# Altium schematic sheet Sensor_Glove_ECG-X01.SchDoc: ECG
size Letter; Organization: GEORGIA TECH; Address1: NORTH AVE NW; Address2: ATLANTA, GA, 30332; DocumentNumber: P001; Revision: X01; SheetNumber: 4; SheetTotal: 4
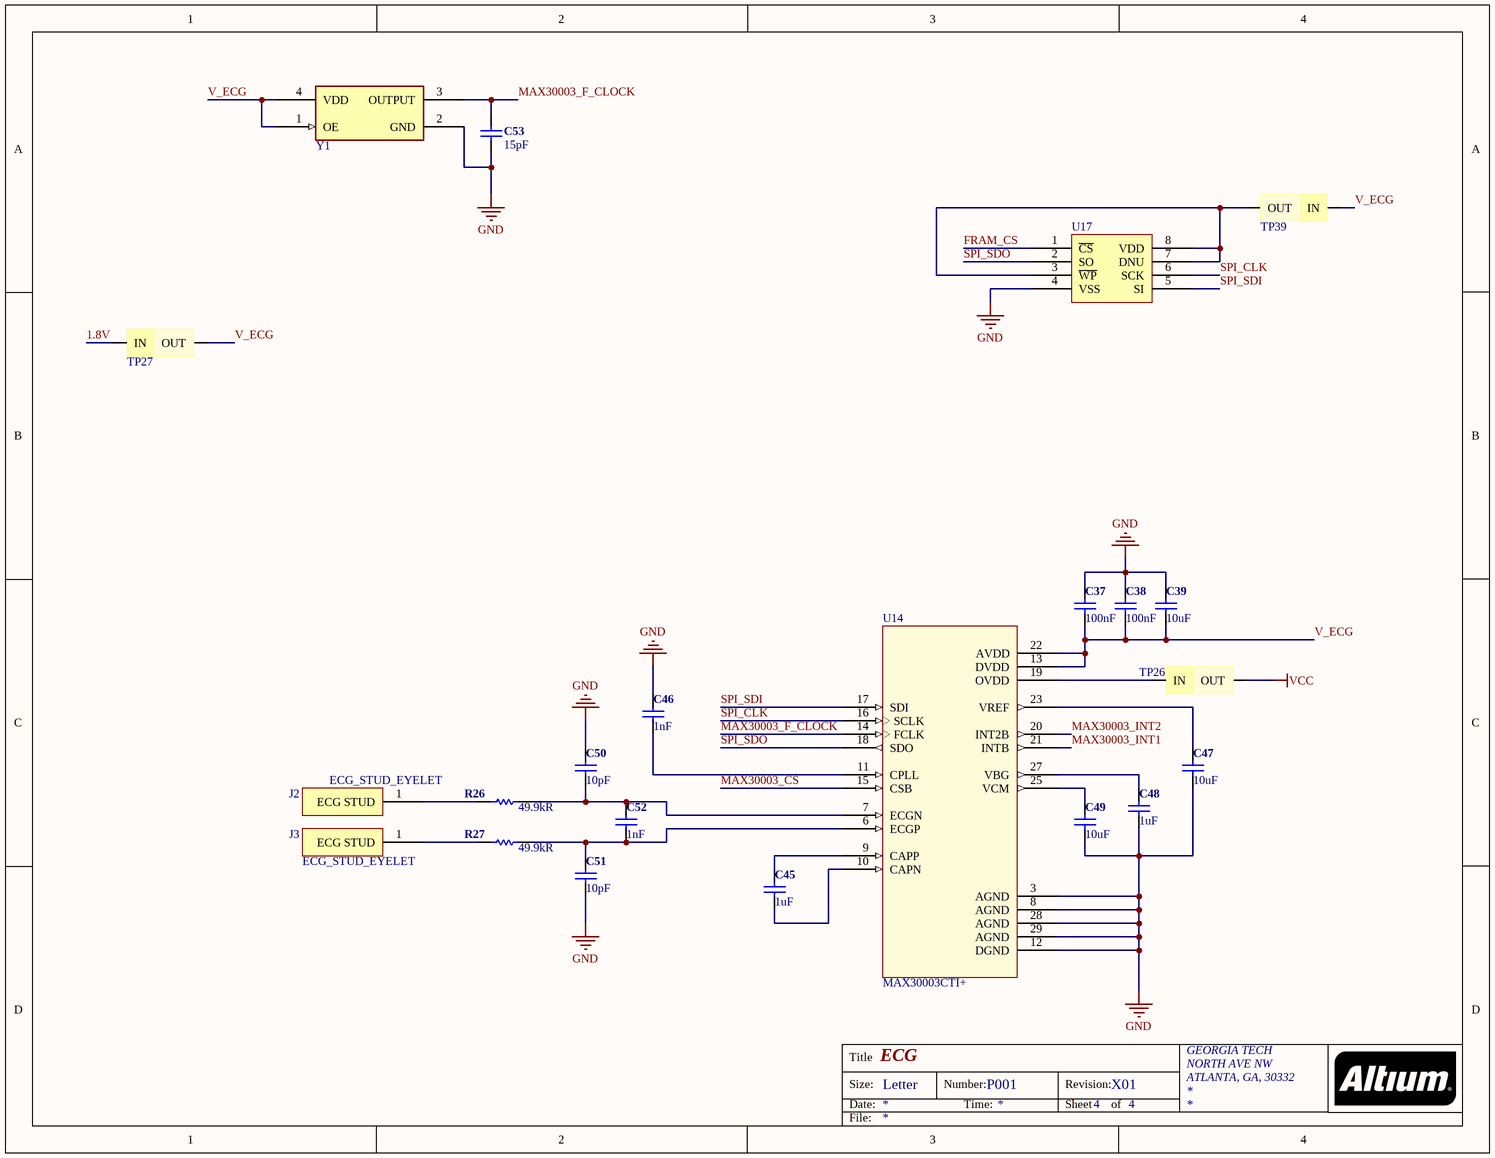
[diagram p0: Sensor_Glove_ECG-X01.SchDoc]

## Parts
C37  100nF  [C0603]
C38  100nF  [C0603]
C39  10uF  [C0603]
C45  1uF  [C0402]
C46  1nF  [C0402]
C47  10uF  [C0603]
C48  1uF  [C0402]
C49  10uF  [C0603]
C50  10pF  [C0402]
C51  10pF  [C0402]
C52  1nF  [C0402]
C53  15pF  [C0402]
J2  ECG_STUD_EYELET  [ECG_STUD]
J3  ECG_STUD_EYELET  [ECG_STUD]
R26  49.9kR  [R0402]
R27  49.9kR  [R0402]
TP26  JUMPER  [JUMPER]  (value not drawn)
TP27  JUMPER  [JUMPER]  (value not drawn)
TP39  JUMPER  [JUMPER]  (value not drawn)
U14  MAX30003CTI+  [QFN50P500X500X80-29N]
U17  8 MB FRAM  [GQFN-8]  (value not drawn)
Y1  OSCILLATOR-32.768KHZ  [OSCILLATOR_4-SMD]  (value not drawn)

## Nets
GND: C37.2 C38.2 C39.2 C46.1 C47.1 C48.2 C49.1 C50.1 C51.2 C53.2 U14.3(AGND) U14.8(AGND) U14.12(DGND) U14.28(AGND) U14.29(AGND) U17.4(VSS) Y1.2(GND)
VCC: TP26.2(OUT)
1.8V: TP27.1(IN)
FRAM_CS: U17.1(~{CS})
MAX30003_CS: U14.15(CSB)
MAX30003_F_CLOCK: C53.1 U14.14(FCLK) Y1.3(OUTPUT)
MAX30003_INT1: U14.21(INTB)
MAX30003_INT2: U14.20(INT2B)
SPI_CLK: U14.16(SCLK) U17.6(SCK)
SPI_SDI: U14.17(SDI) U17.5(SI)
SPI_SDO: U14.18(SDO) U17.2(SO)
V_ECG: C37.1 C38.1 C39.1 TP27.2(OUT) TP39.1(IN) U14.13(DVDD) U14.22(AVDD) Y1.1(OE) Y1.4(VDD)
NetC45_1: C45.1 U14.9(CAPP)
NetC45_2: C45.2 U14.10(CAPN)
NetC46_2: C46.2 U14.11(CPLL)
NetC47_2: C47.2 U14.23(VREF)
NetC48_1: C48.1 U14.27(VBG)
NetC49_2: C49.2 U14.25(VCM)
NetC50_2: C50.2 C52.1 R26.2 U14.7(ECGN)
NetC51_1: C51.1 C52.2 R27.2 U14.6(ECGP)
NetJ2_1: J2.1(ECG_STUD) R26.1
NetJ3_1: J3.1(ECG_STUD) R27.1
NetTP26_1: TP26.1(IN) U14.19(OVDD)
NetTP39_2: TP39.2(OUT) U17.3(~{WP}) U17.7(DNU) U17.8(VDD)

## Notes on the sheet
- Title
- Size:
- Date:
- Letter
- Number:
- Time:
- Revision:
- Sheet
- of
- File:

## Library data of the parts
C37 C38 = C-0603(1608): Ceramic Capacitor, Multilayer, Ceramic, 25V, 80% +Tol, 20% -Tol, Y5V, -82/+22% TC, 0.1uF, Surface Mount, 0402; Manufacturer: Yageo; Manufacturer Part Number: CC0402ZRY5V8BB104; Dissipation Factor: 12.5%; Insulation Resistance: 10GR; ComponentLink1URL: https://datasheet.ciiva.com/169/product-169683.pdf; ComponentLink1Description: https://datasheet.ciiva.com/169/product-169683.pdf; Supplier 1: Digi-Key; Supplier Part Number 1: 311-1375-1-ND; RoHS: Yes; Category: Ceramic Capacitors; Stock 1: 3200380; Pricing 1: 1=0.10000, 10=0.03200, 100=0.01440, 500=0.01028, 1000=0.00808, 2500=0.00734, 5000=0.00676 (USD); Mount: Surface Mount; Case/Package: 0402; Number of Pins: 2; Weight: 2.3E-05oz; Case Code (Metric): 1005; Case Code (Imperial): 0402; Min Operating Temperature: -30°C; Max Operating Temperature: 85°C; Packaging: Tape and Reel; Capacitance: 100nF; Tolerance: 80%; Voltage Rating: 25V; Voltage Rating (DC): 25V; Package Quantity: 1; Dielectric: Y5V; Termination: SMD/SMT; Composition: Ceramic; Length: 1mm; Height: 0.5mm; Width: 0.02inch; Thickness: 0.022inch; Depth: 0.5mm; Radiation Hardening: No; REACH SVHC: Unknown; Lead Free: Lead Free; Halogen Free: Halogen Free; ComponentLink2URL: https://datasheet.ciiva.com:443/pdfs/VipMasterIC/IC/YAGO/YAGO-S-A0004841839/YAGO-S-A0004841839-1.pdf?src-supplier=IHS+Markit; ComponentLink2Description: https://datasheet.ciiva.com:443/pdfs/VipMasterIC/IC/YAGO/YAGO-S-A0004841839/YAGO-S-A0004841839-1.pdf?src-supplier=IHS+Markit; ComponentLink3URL: https://datasheet.ciiva.com/144/mlccorderingcode-144022.pdf?src-supplier=Digi-Key; ComponentLink3Description: https://datasheet.ciiva.com/144/mlccorderingcode-144022.pdf?src-supplier=Digi-Key; ComponentLink4URL: https://datasheet.ciiva.com/144/mlccorderingcode-144023.pdf?src-supplier=Digi-Key; ComponentLink4Description: https://datasheet.ciiva.com/144/mlccorderingcode-144023.pdf?src-supplier=Digi-Key; ComponentLink5URL: https://datasheet.ciiva.com/144/mlccorderingcode-144024.pdf?src-supplier=Digi-Key; ComponentLink5Description: https://datasheet.ciiva.com/144/mlccorderingcode-144024.pdf?src-supplier=Digi-Key; ComponentLink6URL: https://datasheet.ciiva.com/7978/1132289-7978124.pdf?src-supplier=Element14; ComponentLink6Description: https://datasheet.ciiva.com/7978/1132289-7978124.pdf?src-supplier=Element14; ComponentLink7URL: https://datasheet.ciiva.com/11586/upy-gphc-y5v-6-3v-to-50v-5-11586526.pdf?src-supplier=Avnet; ComponentLink7Description: https://datasheet.ciiva.com/11586/upy-gphc-y5v-6-3v-to-50v-5-11586526.pdf?src-supplier=Avnet; ComponentLink8URL: https://datasheet.ciiva.com/17437/upy-gphc-y5v-6-3v-to-50v-5-17437230.pdf?src-supplier=Avnet+Europe; ComponentLink8Description: https://datasheet.ciiva.com/17437/upy-gphc-y5v-6-3v-to-50v-5-17437230.pdf?src-supplier=Avnet+Europe
C39 C47 C49 = C-0603(1608): Ceramic Capacitor, Multilayer, Ceramic, 25V, 20% +Tol, 20% -Tol, X5R, 15% TC, 10uF, Surface Mount, 0603; Manufacturer: Murata; Manufacturer Part Number: GRM188R61E106MA73J; ComponentLink1URL: https://datasheet.ciiva.com/169/product-169683.pdf; ComponentLink1Description: https://datasheet.ciiva.com/169/product-169683.pdf; Supplier 1: Digi-Key; Supplier Part Number 1: 490-12737-1-ND; RoHS: Yes; Category: Ceramic Capacitors; Stock 1: 57394; Pricing 1: 1=0.46000, 10=0.32200, 100=0.19320, 500=0.14488, 1000=0.12235, 2500=0.11591, 5000=0.10947 (USD); Mount: Surface Mount; Case/Package: 0603; Weight: 0.000222oz; Case Code (Imperial): 0603; Case Code (Metric): 1608; Min Operating Temperature: -55°C; Max Operating Temperature: 85°C; Tolerance: 20%; Packaging: Tape and Reel; Capacitance: 10uF; Voltage Rating: 25V; Dielectric: X5R; Termination: SMD/SMT; Composition: Ceramic; Voltage Rating (DC): 25V; Package Quantity: 10000; Length: 0.063inch; Height: 0.8mm; Width: 0.031inch; Thickness: 0.039inch; ComponentLink2URL: https://datasheet.ciiva.com:443/pdfs/VipMasterIC/IC/MURE/MURE-S-A0004349797/MURE-S-A0004352800-1.pdf?src-supplier=IHS+Markit; ComponentLink2Description: https://datasheet.ciiva.com:443/pdfs/VipMasterIC/IC/MURE/MURE-S-A0004349797/MURE-S-A0004352800-1.pdf?src-supplier=IHS+Markit; ComponentLink3URL: http://www.mouser.com/ds/2/281/GRM188R61E106MA73-01-1064626.pdf?src-supplier=Mouser; ComponentLink3Description: http://www.mouser.com/ds/2/281/GRM188R61E106MA73-01-1064626.pdf?src-supplier=Mouser; ComponentLink4URL: https://search.murata.co.jp/Ceramy/image/img/A01X/G101/ENG/GRM188R61E106MA73-01.pdf?src-supplier=Digi-Key; ComponentLink4Description: https://search.murata.co.jp/Ceramy/image/img/A01X/G101/ENG/GRM188R61E106MA73-01.pdf?src-supplier=Digi-Key
C45 C48 = C-0402(1005): Ceramic Capacitor, Multilayer, Ceramic, 6.3V, 20% +Tol, 20% -Tol, X5R, 15% TC, 1uF, Surface Mount, 0402; Manufacturer: Yageo; Manufacturer Part Number: CC0402MRX5R5BB105; Dissipation Factor: 10%; ComponentLink1URL: https://datasheet.ciiva.com/169/product-169683.pdf; ComponentLink1Description: https://datasheet.ciiva.com/169/product-169683.pdf; Supplier 1: Digi-Key; Supplier Part Number 1: 311-1441-1-ND; RoHS: Yes; Category: Ceramic Capacitors; Stock 1: 16697; Pricing 1: 1=0.13000, 10=0.08900, 100=0.04200, 500=0.02946, 1000=0.02439, 2500=0.02270, 5000=0.02076 (USD); Mount: Surface Mount; Case/Package: 0402; Number of Pins: 2; Case Code (Imperial): 0402; Case Code (Metric): 1005; Min Operating Temperature: -55°C; Max Operating Temperature: 85°C; Capacitance: 1uF; Tolerance: 20%; Voltage Rating: 6.3V; Voltage Rating (DC): 6.3V; Packaging: Tape and Reel; Package Quantity: 1; Dielectric: X5R; Termination: SMD/SMT; Composition: Ceramic; Length: 1mm; Height: 0.5mm; Width: 0.5mm; Thickness: 0.022inch; Depth: 0.5mm; Lead Free: Lead Free; Halogen Free: Halogen Free; ComponentLink2URL: https://datasheet.ciiva.com:443/pdfs/VipMasterIC/IC/YAGO/YAGO-S-A0006851646/YAGO-S-A0006851646-1.pdf?src-supplier=IHS+Markit; ComponentLink2Description: https://datasheet.ciiva.com:443/pdfs/VipMasterIC/IC/YAGO/YAGO-S-A0006851646/YAGO-S-A0006851646-1.pdf?src-supplier=IHS+Markit; ComponentLink3URL: https://datasheet.ciiva.com/176/mlccorderingcode-176806.pdf?src-supplier=Digi-Key; ComponentLink3Description: https://datasheet.ciiva.com/176/mlccorderingcode-176806.pdf?src-supplier=Digi-Key; ComponentLink4URL: https://datasheet.ciiva.com/176/mlccorderingcode-176807.pdf?src-supplier=Digi-Key; ComponentLink4Description: https://datasheet.ciiva.com/176/mlccorderingcode-176807.pdf?src-supplier=Digi-Key; ComponentLink5URL: https://datasheet.ciiva.com/176/mlccorderingcode-176808.pdf?src-supplier=Digi-Key; ComponentLink5Description: https://datasheet.ciiva.com/176/mlccorderingcode-176808.pdf?src-supplier=Digi-Key
C46 C52 = C-0402(1005): Ceramic Capacitor, Multilayer, Ceramic, 10V, 5% +Tol, 5% -Tol, C0G, -/+30ppm/Cel TC, 0.001uF, 0402; Manufacturer: KEMET; Manufacturer Part Number: C0402C102J8GAC7867; ComponentLink1URL: https://datasheet.ciiva.com/169/product-169683.pdf; ComponentLink1Description: https://datasheet.ciiva.com/169/product-169683.pdf; Supplier 1: Digi-Key; Supplier Part Number 1: 399-14868-1-ND; RoHS: No; Category: Ceramic Capacitors; Stock 1: 20757; Pricing 1: 1=0.26000, 10=0.18100, 100=0.10240, 500=0.07226, 1000=0.06322, 2500=0.06022, 5000=0.05570 (USD); Mount: Surface Mount; Case/Package: 0402; Case Code (Imperial): 0402; Case Code (Metric): 1005; Min Operating Temperature: -55°C; Max Operating Temperature: 125°C; Packaging: Tape and Reel; Capacitance: 1nF; Tolerance: 5%; Voltage Rating: 10V; ComponentLink2URL: https://datasheet.ciiva.com:443/pdfs/VipMasterIC/IC/KEME/KEMES02331/KEMES02331-1.pdf?src-supplier=IHS+Markit; ComponentLink2Description: https://datasheet.ciiva.com:443/pdfs/VipMasterIC/IC/KEME/KEMES02331/KEMES02331-1.pdf?src-supplier=IHS+Markit; ComponentLink3URL: https://api.kemet.com/component-edge/download/datasheet/C0402C102J8GAC7867.pdf?src-supplier=Digi-Key; ComponentLink3Description: https://api.kemet.com/component-edge/download/datasheet/C0402C102J8GAC7867.pdf?src-supplier=Digi-Key
C50 C51 = C-0402(1005): Ceramic Capacitor, Multilayer, Ceramic, 50V, 5% +Tol, 5% -Tol, C0G, 30ppm/Cel TC, 0.00001uF, Surface Mount, 0402; Manufacturer: Murata; Manufacturer Part Number: GJM1555C1H100JB01D; ComponentLink1URL: https://datasheet.ciiva.com/169/product-169683.pdf; ComponentLink1Description: https://datasheet.ciiva.com/169/product-169683.pdf; Supplier 1: Digi-Key; Supplier Part Number 1: 490-3113-1-ND; RoHS: Yes; Category: Ceramic Capacitors; Stock 1: 1839463; Pricing 1: 1=0.29000, 10=0.19700, 100=0.10000, 500=0.06842, 1000=0.06052, 2500=0.05789, 5000=0.05262 (USD); Mount: Surface Mount; Case/Package: 0402; Case Code (Metric): 1005; Case Code (Imperial): 0402; Min Operating Temperature: -55°C; Max Operating Temperature: 125°C; Capacitance: 10pF; Tolerance: 5%; Packaging: Tape and Reel; Voltage Rating: 50V; Package Quantity: 1; Voltage Rating (DC): 50V; Dielectric: C0G; Termination: SMD/SMT; Voltage: 50V; Length: 1mm; Height: 0.5mm; Width: 0.02inch; Thickness: 0.022inch; Depth: 0.5mm; Radiation Hardening: No; Lead Free: Lead Free; ComponentLink2URL: https://datasheet.ciiva.com:443/pdfs/VipMasterIC/IC/MURE/MURE-S-A0004378008/MURE-S-A0004383508-1.pdf?src-supplier=IHS+Markit; ComponentLink2Description: https://datasheet.ciiva.com:443/pdfs/VipMasterIC/IC/MURE/MURE-S-A0004378008/MURE-S-A0004383508-1.pdf?src-supplier=IHS+Markit; ComponentLink3URL: https://datasheet.ciiva.com/18183/getdatasheetpartid-228488-18183804.pdf?src-supplier=Verical; ComponentLink3Description: https://datasheet.ciiva.com/18183/getdatasheetpartid-228488-18183804.pdf?src-supplier=Verical; ComponentLink4URL: https://datasheet.ciiva.com/29542/partnumbering-e-01-29542760.pdf?src-supplier=Digi-Key; ComponentLink4Description: https://datasheet.ciiva.com/29542/partnumbering-e-01-29542760.pdf?src-supplier=Digi-Key; ComponentLink5URL: https://datasheet.ciiva.com/29542/partnumbering-e-01-29542761.pdf?src-supplier=Digi-Key; ComponentLink5Description: https://datasheet.ciiva.com/29542/partnumbering-e-01-29542761.pdf?src-supplier=Digi-Key; ComponentLink6URL: https://datasheet.ciiva.com/165/partnumbering-e-01-165051.pdf?src-supplier=Digi-Key; ComponentLink6Description: https://datasheet.ciiva.com/165/partnumbering-e-01-165051.pdf?src-supplier=Digi-Key; ComponentLink7URL: https://datasheet.ciiva.com/11607/product-11607356.pdf?src-supplier=Avnet; ComponentLink7Description: https://datasheet.ciiva.com/11607/product-11607356.pdf?src-supplier=Avnet
C53 = C-0402(1005): Ceramic Capacitor, Multilayer, Ceramic, 50V, 1% +Tol, 1% -Tol, C0G, -/+30ppm/Cel TC, 0.000015uF, Surface Mount, 0402; Manufacturer: Murata; Manufacturer Part Number: GJM1555C1H150FB01D; ComponentLink1URL: https://datasheet.ciiva.com/169/product-169683.pdf; ComponentLink1Description: https://datasheet.ciiva.com/169/product-169683.pdf; Supplier 1: Digi-Key; Supplier Part Number 1: 490-11191-1-ND; RoHS: Yes; Category: Ceramic Capacitors; Stock 1: 66158; Pricing 1: 1=0.24000, 10=0.16700, 50=0.10000, 100=0.08440, 500=0.05778, 1000=0.05111, 2500=0.04888, 5000=0.04444 (USD); Mount: Surface Mount; Case/Package: 0402; Case Code (Imperial): 0402; Case Code (Metric): 1005; Min Operating Temperature: -55°C; Max Operating Temperature: 125°C; Capacitance: 15pF; Tolerance: 1%; Packaging: Tape and Reel; Voltage Rating: 50V; Voltage Rating (DC): 50V; Package Quantity: 10000; Dielectric: C0G; Termination: SMD/SMT; Voltage: 50V; Length: 1mm; Height: 0.5mm; Width: 0.02inch; Thickness: 0.022inch; Depth: 0.5mm; Radiation Hardening: No; ComponentLink2URL: https://datasheet.ciiva.com:443/pdfs/VipMasterIC/IC/MURE/MURE-S-A0004383799/MURE-S-A0004384018-1.pdf?src-supplier=IHS+Markit; ComponentLink2Description: https://datasheet.ciiva.com:443/pdfs/VipMasterIC/IC/MURE/MURE-S-A0004383799/MURE-S-A0004384018-1.pdf?src-supplier=IHS+Markit; ComponentLink3URL: https://datasheet.ciiva.com/11608/c02e-11608383.pdf?src-supplier=Avnet; ComponentLink3Description: https://datasheet.ciiva.com/11608/c02e-11608383.pdf?src-supplier=Avnet
J2 J3 = ECG_STUD_EYELET: 996 Stud/Eyelet combination, LUF: 3.25mm/6.25mm, O.D.: 10.25mm, https://www.romed.com/medical-electrical-snap-fasteners.aspx
R26 R27 = R-0402(1005): Fixed Resistor, Metal Glaze/thick Film, 0.0625W, 49900ohm, 50V, 1% +/-Tol, 100ppm/Cel, Surface Mount, 0402; Manufacturer: Yageo; Manufacturer Part Number: AC0402FR-0749K9L; Power Rating: 62.5mW; Temperature Coefficient: 100ppm/°C; Max Power Dissipation: 63mW; Supplier 1: Digi-Key; Supplier Part Number 1: YAG3493CT-ND; RoHS: Yes; Category: Chip SMD Resistors; Stock 1: 87188; Pricing 1: 1=0.10000, 10=0.02100, 100=0.00870, 1000=0.00390, 2500=0.00338, 5000=0.00279 (USD); Case/Package: 0402; Weight: 2.3E-05oz; Case Code (Imperial): 0402; Case Code (Metric): 1005; Min Operating Temperature: -55°C; Max Operating Temperature: 155°C; Voltage Rating: 50V; Resistance: 49.9kR; Tolerance: 1%; Packaging: Tape and Reel; Termination: SMD/SMT; Composition: Thick Film; Number of Terminations: 2; Features: Moisture Resistant,Automotive AEC-Q200; Length: 0.039inch; Height: 0.015inch; Width: 0.5mm; ComponentLink1URL: https://datasheet.ciiva.com:443/pdfs/VipMasterIC/IC/YAGO/YAGO-S-A0003597364/YAGO-S-A0003597364-1.pdf?src-supplier=IHS+Markit; ComponentLink1Description: https://datasheet.ciiva.com:443/pdfs/VipMasterIC/IC/YAGO/YAGO-S-A0003597364/YAGO-S-A0003597364-1.pdf?src-supplier=IHS+Markit; ComponentLink2URL: http://www.mouser.com/ds/2/447/yageodocoutput-1111992.pdf?src-supplier=Mouser; ComponentLink2Description: http://www.mouser.com/ds/2/447/yageodocoutput-1111992.pdf?src-supplier=Mouser; ComponentLink3URL: http://www.yageo.com/NewPortal/yageodocoutput?fileName=/pdf/R-Chip/PYu-AC_51_RoHS_L_6.pdf&src-supplier=Digi-Key; ComponentLink3Description: http://www.yageo.com/NewPortal/yageodocoutput?fileName=/pdf/R-Chip/PYu-AC_51_RoHS_L_6.pdf&src-supplier=Digi-Key
TP26 TP27 TP39 = JUMPER: SHUNT LP W/HANDLE 2 POS 30AU; Manufacturer: TE Connectivity; Manufacturer Part Number: 8815452; Number of Contacts: 2; Contact Current Rating: 3A; Contact Resistance: 15mR; Gender: Female; Pitch: 2.54mm; Approvals: UL,CSA; Supplier 1: Digi-Key; Supplier Part Number 1: A26242-ND; RoHS: Yes; Category: Headers and Wire Housings; Stock 1: 2099; Pricing 1: 1=0.280000, 10=0.262000, 25=0.223600, 50=0.195600, 100=0.181700, 250=0.160760, 500=0.153760, 1000=0.125800, 2500=0.115320 (USD); Contact Plating: Gold; Housing Color: Black; Housing Material: Thermoplastic; Contact Material: Bronze; Color: Black; Min Operating Temperature: -65°C; Max Operating Temperature: 105°C; Number of Rows: 1; Package Quantity: 14000; Packaging: Bag; Orientation: Straight; Number of Positions: 2; Contact Gender: Female; Current Rating: 3A; Termination: Solder; Length: 5.08mm; Height: 10.9mm; Depth: 10.9mm; Width: 2.5mm; Radiation Hardening: No; Flammability Rating: UL94 V-0; REACH SVHC: No SVHC; ComponentLink1URL: https://datasheet.ciiva.com/1455/92946-1455888.pdf?src-supplier=Newark; ComponentLink1Description: https://datasheet.ciiva.com/1455/92946-1455888.pdf?src-supplier=Newark; ComponentLink2URL: https://datasheet.ciiva.com/19459/841467-19459897.pdf?src-supplier=Jameco; ComponentLink2Description: https://datasheet.ciiva.com/19459/841467-19459897.pdf?src-supplier=Jameco; ComponentLink3URL: https://datasheet.ciiva.com/15174/getdatasheetpartid-155768-15174939.pdf?src-supplier=Verical; ComponentLink3Description: https://datasheet.ciiva.com/15174/getdatasheetpartid-155768-15174939.pdf?src-supplier=Verical; ComponentLink4URL: https://datasheet.ciiva.com/11754/0900766b80da19e8-11754990.pdf?src-supplier=RSComponents; ComponentLink4Description: https://datasheet.ciiva.com/11754/0900766b80da19e8-11754990.pdf?src-supplier=RSComponents; ComponentLink5URL: https://datasheet.ciiva.com/30154/eng-cs-1307819-section-6-7and8-0808-30154293.pdf?src-supplier=Onlinecomponents.com; ComponentLink5Description: https://datasheet.ciiva.com/30154/eng-cs-1307819-section-6-7and8-0808-30154293.pdf?src-supplier=Onlinecomponents.com; ComponentLink6URL: https://datasheet.ciiva.com/767/eng-cd-881545-k3-767850.pdf?src-supplier=Digi-Key; ComponentLink6Description: https://datasheet.ciiva.com/767/eng-cd-881545-k3-767850.pdf?src-supplier=Digi-Key; ComponentLink7URL: https://datasheet.ciiva.com/3120/eng-cs-1307819-section-6-7and8-0808-3120202.pdf?src-supplier=Avnet; ComponentLink7Description: https://datasheet.ciiva.com/3120/eng-cs-1307819-section-6-7and8-0808-3120202.pdf?src-supplier=Avnet
U14 = MAX30003CTI+: Analog Circuit, 1 Func, CMOS; Manufacturer: Maxim; Min Supply Voltage: 1.2V; Max Supply Voltage: 2V; Supplier 1: Digi-Key; Supplier Part Number 1: MAX30003CTI+-ND; RoHS: No; Category: RF Semiconductors and Devices; Stock 1: 286; Pricing 1: 1=8.21000, 10=7.41200, 25=7.06760, 100=5.86090, 250=5.34380, 500=4.99902, 1000=4.98888 (USD); Number of Pins: 28; Min Operating Temperature: 0°C; Max Operating Temperature: 70°C; REACH SVHC: No SVHC; ComponentLink1URL: https://datasheet.ciiva.com:443/pdfs/VipMasterIC/IC/MAXM/MAXM-S-A0009086108/MAXM-S-A0009086108-1.pdf?src-supplier=IHS+Markit; ComponentLink1Description: https://datasheet.ciiva.com:443/pdfs/VipMasterIC/IC/MAXM/MAXM-S-A0009086108/MAXM-S-A0009086108-1.pdf?src-supplier=IHS+Markit; ComponentLink2URL: http://www.farnell.com/datasheets/2159846.pdf?src-supplier=Farnell; ComponentLink2Description: http://www.farnell.com/datasheets/2159846.pdf?src-supplier=Farnell; ComponentLink3URL: https://pdfserv.maximintegrated.com/en/an/MAX-ECG-MONITOR-User-Guide.pdf?src-supplier=Digi-Key; ComponentLink3Description: https://pdfserv.maximintegrated.com/en/an/MAX-ECG-MONITOR-User-Guide.pdf?src-supplier=Digi-Key; ComponentLink4URL: http://www.farnell.com/datasheets/2159846.pdf?src-supplier=Element14; ComponentLink4Description: http://www.farnell.com/datasheets/2159846.pdf?src-supplier=Element14; Manufacturer Part Number: MAX30003CTI+
U17 = CY15B108QI: Memory Circuit, 8 MB FRAM; Manufacturer: Cypress; Manufacturer Part Number: CY15B108QI-20LPXI; Supplier 1: Digi-Key; Supplier Part Number 1: 428-4721-ND; RoHS: No; Category: Memory; Stock 1: 1421; Pricing 1: 1=32.50000, 10=30.55500, 25=29.50560, 50=28.56820, 100=25.13780, 250=24.46300, 500=23.71318, 1000=23.43200 (USD); ComponentLink1URL: https://datasheet.ciiva.com:443/pdfs/VipMasterIC/IC/CYPR/CYPR-S-A0008987076/CYPR-S-A0008987076-1.pdf?src-supplier=IHS+Markit; ComponentLink1Description: https://datasheet.ciiva.com:443/pdfs/VipMasterIC/IC/CYPR/CYPR-S-A0008987076/CYPR-S-A0008987076-1.pdf?src-supplier=IHS+Markit
Y1 = OSCILLATOR_32K768: Oscillator Xo 0.032768MHZ ±25PPM 15PF Lvcmos/lvttl 55% 1.8V 4-PIN Csmd T/r; Manufacturer: Diodes; Manufacturer Part Number: KX2013B0032.768000; Max Supply Current: 30uA; Max Supply Voltage: 1.89V; Min Supply Voltage: 1.71V; Supplier 1: Digi-Key; Supplier Part Number 1: 31-KX2013B0032.768000CT-ND; RoHS: Yes; Category: Oscillators; Stock 1: 1562; Pricing 1: 1=3.22000, 10=3.14700, 50=2.99700, 100=2.62240, 500=2.54746, 1000=2.17283 (USD); Mount: Surface Mount; Case/Package: SMD/SMT; Min Operating Temperature: -20°C; Max Operating Temperature: 70°C; Frequency Stability: 25ppm; Termination: SMD/SMT; Max Duty Cycle: 55%; Frequency: 32.768kHz; Load Capacitance: 15pF; Packaging: Cut Strip; Package Quantity: 100; Operating Supply Voltage: 1.8V; Length: 0.079inch; Height: 0.033inch; Width: 0.063inch; ComponentLink1URL: http://www.mouser.com/ds/2/322/KX201-Rev-A-461590.pdf?src-supplier=Mouser; ComponentLink1Description: http://www.mouser.com/ds/2/322/KX201-Rev-A-461590.pdf?src-supplier=Mouser; ComponentLink2URL: https://www.pericom.com/assets/Datasheets/KX201.pdf?src-supplier=Digi-Key; ComponentLink2Description: https://www.pericom.com/assets/Datasheets/KX201.pdf?src-supplier=Digi-Key; ComponentLink3URL: https://www.diodes.com/assets/Datasheets/KX201.pdf?src-supplier=Digi-Key; ComponentLink3Description: https://www.diodes.com/assets/Datasheets/KX201.pdf?src-supplier=Digi-Key